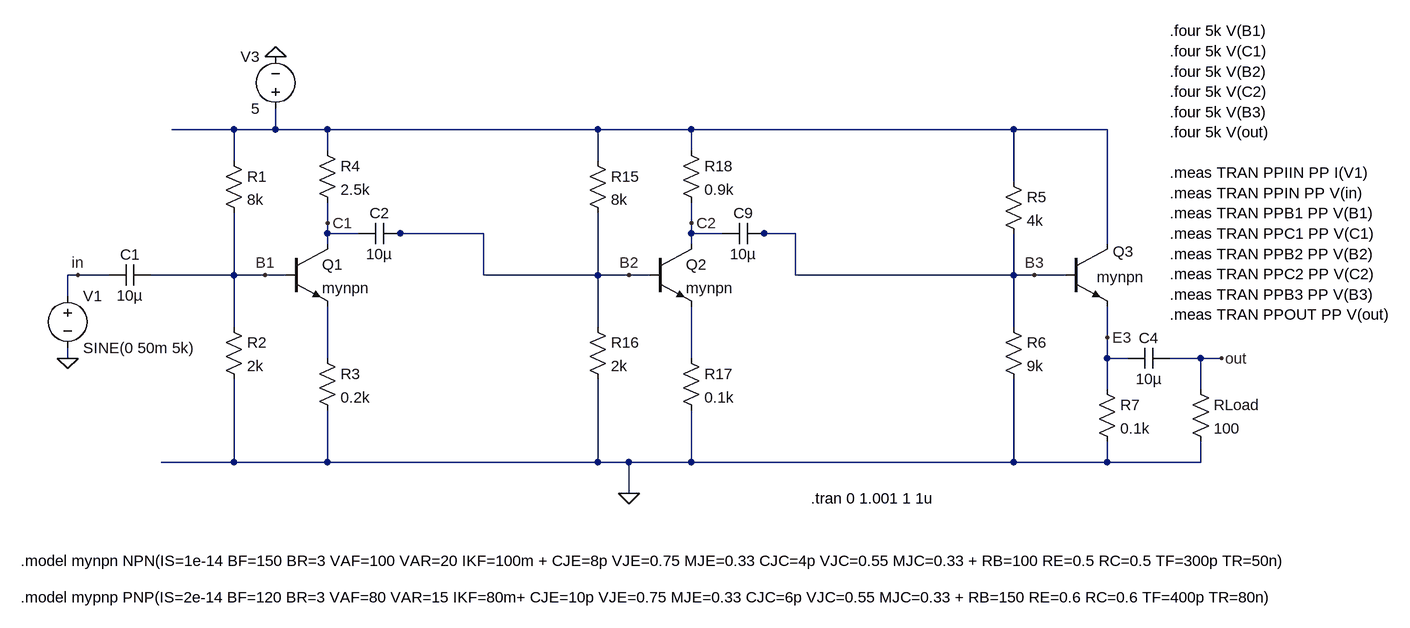
[diagram p0: schematic amplifier.asc]
amplifier.asc, the LTspice schematic file:
Version 4
SHEET 1 2824 680
WIRE -176 -96 -272 -96
WIRE -112 -96 -112 -128
WIRE -112 -96 -176 -96
WIRE -32 -96 -112 -96
WIRE 384 -96 -32 -96
WIRE 528 -96 384 -96
WIRE 1024 -96 528 -96
WIRE 1168 -96 1024 -96
WIRE -32 -64 -32 -96
WIRE 528 -64 528 -96
WIRE -176 -48 -176 -96
WIRE 384 -48 384 -96
WIRE 1024 -16 1024 -96
WIRE -32 48 -32 16
WIRE 528 48 528 16
WIRE -32 64 -32 48
WIRE 16 64 -32 64
WIRE 80 64 64 64
WIRE 208 64 80 64
WIRE 528 64 528 48
WIRE 576 64 528 64
WIRE 640 64 624 64
WIRE 688 64 640 64
WIRE -32 80 -32 64
WIRE 528 80 528 64
WIRE 1168 80 1168 -96
WIRE -416 128 -432 128
WIRE -368 128 -416 128
WIRE -176 128 -176 32
WIRE -176 128 -304 128
WIRE -128 128 -176 128
WIRE -96 128 -128 128
WIRE 208 128 208 64
WIRE 384 128 384 32
WIRE 384 128 208 128
WIRE 432 128 384 128
WIRE 464 128 432 128
WIRE 688 128 688 64
WIRE 1024 128 1024 64
WIRE 1024 128 688 128
WIRE 1056 128 1024 128
WIRE 1104 128 1056 128
WIRE -432 160 -432 128
WIRE -176 208 -176 128
WIRE 384 208 384 128
WIRE 1024 208 1024 128
WIRE 1168 224 1168 176
WIRE -432 256 -432 240
WIRE -32 256 -32 176
WIRE 528 256 528 176
WIRE 1168 256 1168 224
WIRE 1200 256 1168 256
WIRE 1312 256 1264 256
WIRE 1344 256 1312 256
WIRE 1168 304 1168 256
WIRE 1312 304 1312 256
WIRE -176 416 -176 288
WIRE -176 416 -288 416
WIRE -32 416 -32 336
WIRE -32 416 -176 416
WIRE 384 416 384 288
WIRE 384 416 -32 416
WIRE 432 416 384 416
WIRE 528 416 528 336
WIRE 528 416 432 416
WIRE 1024 416 1024 288
WIRE 1024 416 528 416
WIRE 1168 416 1168 384
WIRE 1168 416 1024 416
WIRE 1312 416 1312 384
WIRE 1312 416 1168 416
WIRE 432 464 432 416
FLAG -432 256 0
FLAG -112 -208 0
FLAG -32 48 C1
FLAG 1168 224 E3
FLAG 1056 128 B3
FLAG -128 128 B1
FLAG -416 128 in
FLAG 1344 256 out
FLAG 432 464 0
FLAG 528 48 C2
FLAG 432 128 B2
SYMBOL npn -96 80 R0
SYMATTR InstName Q1
SYMATTR Value mynpn
SYMBOL res -192 -64 R0
SYMATTR InstName R1
SYMATTR Value 8k
SYMBOL res -192 192 R0
SYMATTR InstName R2
SYMATTR Value 2k
SYMBOL res -48 240 R0
SYMATTR InstName R3
SYMATTR Value 0.2k
SYMBOL res -48 -80 R0
SYMATTR InstName R4
SYMATTR Value 2.5k
SYMBOL cap -304 112 R90
WINDOW 0 0 32 VBottom 2
WINDOW 3 32 32 VTop 2
SYMATTR InstName C1
SYMATTR Value 10µ
SYMBOL voltage -432 144 R0
WINDOW 123 0 0 Left 0
WINDOW 39 0 0 Left 0
SYMATTR InstName V1
SYMATTR Value SINE(0 50m 5k)
SYMBOL voltage -112 -112 R180
WINDOW 0 24 96 Left 2
WINDOW 3 24 16 Left 2
SYMATTR InstName V3
SYMATTR Value 5
SYMBOL npn 1104 80 R0
WINDOW 0 73 12 Left 2
WINDOW 3 48 51 Left 2
SYMATTR InstName Q3
SYMATTR Value mynpn
SYMBOL res 1008 -32 R0
SYMATTR InstName R5
SYMATTR Value 4k
SYMBOL res 1008 192 R0
SYMATTR InstName R6
SYMATTR Value 9k
SYMBOL res 1152 288 R0
SYMATTR InstName R7
SYMATTR Value 0.1k
SYMBOL cap 1264 240 R90
WINDOW 0 0 32 VBottom 2
WINDOW 3 32 32 VTop 2
SYMATTR InstName C4
SYMATTR Value 10µ
SYMBOL cap 80 48 R90
WINDOW 0 0 32 VBottom 2
WINDOW 3 32 32 VTop 2
SYMATTR InstName C2
SYMATTR Value 10µ
SYMBOL res 1296 288 R0
SYMATTR InstName RLoad
SYMATTR Value 100
SYMBOL npn 464 80 R0
SYMATTR InstName Q2
SYMATTR Value mynpn
SYMBOL res 368 -64 R0
SYMATTR InstName R15
SYMATTR Value 8k
SYMBOL res 368 192 R0
SYMATTR InstName R16
SYMATTR Value 2k
SYMBOL res 512 240 R0
SYMATTR InstName R17
SYMATTR Value 0.1k
SYMBOL cap 640 48 R90
WINDOW 0 0 32 VBottom 2
WINDOW 3 32 32 VTop 2
SYMATTR InstName C9
SYMATTR Value 10µ
SYMBOL res 512 -80 R0
SYMATTR InstName R18
SYMATTR Value 0.9k
TEXT -504 568 Left 2 !.model mynpn NPN(IS=1e-14 BF=150 BR=3 VAF=100 VAR=20 IKF=100m + CJE=8p VJE=0.75 MJE=0.33 CJC=4p VJC=0.55 MJC=0.33 + RB=100 RE=0.5 RC=0.5 TF=300p TR=50n)
TEXT -504 624 Left 2 !.model mypnp PNP(IS=2e-14 BF=120 BR=3 VAF=80 VAR=15 IKF=80m+ CJE=10p VJE=0.75 MJE=0.33 CJC=6p VJC=0.55 MJC=0.33 + RB=150 RE=0.6 RC=0.6 TF=400p TR=80n)
TEXT 712 472 Left 2 !.tran 0 1.001 1 1u
TEXT 1264 -248 Left 2 !.four 5k V(B1)\n.four 5k V(C1)\n.four 5k V(B2)\n.four 5k V(C2)\n.four 5k V(B3)\n.four 5k V(out)\n \n.meas TRAN PPIIN PP I(V1)\n.meas TRAN PPIN PP V(in)\n.meas TRAN PPB1 PP V(B1)\n.meas TRAN PPC1 PP V(C1)\n.meas TRAN PPB2 PP V(B2)\n.meas TRAN PPC2 PP V(C2)\n.meas TRAN PPB3 PP V(B3)\n.meas TRAN PPOUT PP V(out)

The netlist it stands for:
* amplifier.asc
Q1 C1 B1 N002 0 mynpn
R1 N001 B1 8k
R2 B1 0 2k
R3 N002 0 0.2k
R4 N001 C1 2.5k
C1 B1 in 10µ
V1 in 0 SINE(0 50m 5k)
V3 N001 0 5
Q3 N001 B3 E3 0 mynpn
R5 N001 B3 4k
R6 B3 0 9k
R7 E3 0 0.1k
C4 out E3 10µ
C2 B2 C1 10µ
RLoad out 0 100
Q2 C2 B2 N003 0 mynpn
R15 N001 B2 8k
R16 B2 0 2k
R17 N003 0 0.1k
C9 B3 C2 10µ
R18 N001 C2 0.9k
.model NPN NPN
.model PNP PNP
.lib standard.bjt
.model mynpn NPN(IS=1e-14 BF=150 BR=3 VAF=100 VAR=20 IKF=100m + CJE=8p VJE=0.75 MJE=0.33 CJC=4p VJC=0.55 MJC=0.33 + RB=100 RE=0.5 RC=0.5 TF=300p TR=50n)
.model mypnp PNP(IS=2e-14 BF=120 BR=3 VAF=80 VAR=15 IKF=80m+ CJE=10p VJE=0.75 MJE=0.33 CJC=6p VJC=0.55 MJC=0.33 + RB=150 RE=0.6 RC=0.6 TF=400p TR=80n)
.tran 0 1.001 1 1u
.four 5k V(B1)
.four 5k V(C1)
.four 5k V(B2)
.four 5k V(C2)
.four 5k V(B3)
.four 5k V(out)
.meas TRAN PPIIN PP I(V1)
.meas TRAN PPIN PP V(in)
.meas TRAN PPB1 PP V(B1)
.meas TRAN PPC1 PP V(C1)
.meas TRAN PPB2 PP V(B2)
.meas TRAN PPC2 PP V(C2)
.meas TRAN PPB3 PP V(B3)
.meas TRAN PPOUT PP V(out)
.backanno
.end